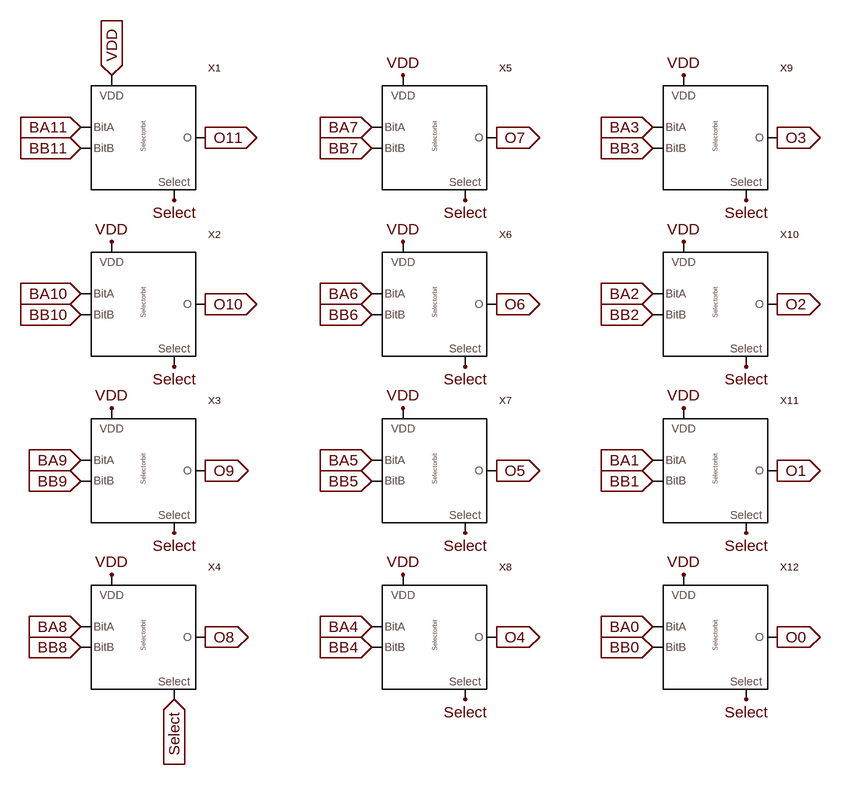
[diagram p0: schematic 12_bit_selector.asc]
12_bit_selector.asc, the LTspice schematic file:
Version 4
SHEET 1 892 944
FLAG 176 80 VDD
FLAG 128 -96 BA7
IOPIN 128 -96 In
FLAG 128 -64 BB7
IOPIN 128 -64 In
FLAG 128 160 BA6
IOPIN 128 160 In
FLAG 128 192 BB6
IOPIN 128 192 In
FLAG 320 -80 O7
IOPIN 320 -80 Out
FLAG 320 176 O6
IOPIN 320 176 Out
FLAG 176 592 VDD
FLAG 128 416 BA5
IOPIN 128 416 In
FLAG 128 448 BB5
IOPIN 128 448 In
FLAG 128 672 BA4
IOPIN 128 672 In
FLAG 128 704 BB4
IOPIN 128 704 In
FLAG 320 432 O5
IOPIN 320 432 Out
FLAG 320 688 O4
IOPIN 320 688 Out
FLAG 176 336 VDD
FLAG 608 80 VDD
FLAG 560 -96 BA3
IOPIN 560 -96 In
FLAG 560 -64 BB3
IOPIN 560 -64 In
FLAG 560 160 BA2
IOPIN 560 160 In
FLAG 560 192 BB2
IOPIN 560 192 In
FLAG 752 -80 O3
IOPIN 752 -80 Out
FLAG 752 176 O2
IOPIN 752 176 Out
FLAG 608 592 VDD
FLAG 560 416 BA1
IOPIN 560 416 In
FLAG 560 448 BB1
IOPIN 560 448 In
FLAG 560 672 BA0
IOPIN 560 672 In
FLAG 560 704 BB0
IOPIN 560 704 In
FLAG 752 432 O1
IOPIN 752 432 Out
FLAG 752 688 O0
IOPIN 752 688 Out
FLAG 608 336 VDD
FLAG 608 -176 VDD
FLAG -272 -176 VDD
IOPIN -272 -176 In
FLAG -272 80 VDD
FLAG -320 -96 BA11
IOPIN -320 -96 In
FLAG -320 -64 BB11
IOPIN -320 -64 In
FLAG -320 160 BA10
IOPIN -320 160 In
FLAG -320 192 BB10
IOPIN -320 192 In
FLAG -128 -80 O11
IOPIN -128 -80 Out
FLAG -128 176 O10
IOPIN -128 176 Out
FLAG -272 592 VDD
FLAG -320 416 BA9
IOPIN -320 416 In
FLAG -320 448 BB9
IOPIN -320 448 In
FLAG -320 672 BA8
IOPIN -320 672 In
FLAG -320 704 BB8
IOPIN -320 704 In
FLAG -128 432 O9
IOPIN -128 432 Out
FLAG -128 688 O8
IOPIN -128 688 Out
FLAG -272 336 VDD
FLAG 176 -176 VDD
FLAG -176 16 Select
FLAG 272 16 Select
FLAG 704 16 Select
FLAG 704 272 Select
FLAG 272 272 Select
FLAG -176 272 Select
FLAG -176 528 Select
FLAG 272 528 Select
FLAG 704 528 Select
FLAG 704 784 Select
FLAG 272 784 Select
FLAG -176 784 Select
IOPIN -176 784 In
SYMBOL Selectorbit -304 0 R0
SYMATTR InstName X1
SYMBOL Selectorbit -304 256 R0
SYMATTR InstName X2
SYMBOL Selectorbit -304 512 R0
SYMATTR InstName X3
SYMBOL Selectorbit -304 768 R0
SYMATTR InstName X4
SYMBOL Selectorbit 144 0 R0
SYMATTR InstName X5
SYMBOL Selectorbit 144 256 R0
SYMATTR InstName X6
SYMBOL Selectorbit 144 512 R0
SYMATTR InstName X7
SYMBOL Selectorbit 144 768 R0
SYMATTR InstName X8
SYMBOL Selectorbit 576 0 R0
SYMATTR InstName X9
SYMBOL Selectorbit 576 256 R0
SYMATTR InstName X10
SYMBOL Selectorbit 576 512 R0
SYMATTR InstName X11
SYMBOL Selectorbit 576 768 R0
SYMATTR InstName X12

The netlist it stands for:
* 12_bit_selector.asc
XX1 BA11 BB11 O11 Select VDD Selectorbit  ; pins BitA BitB O Select VDD
XX2 BA10 BB10 O10 Select VDD Selectorbit  ; pins BitA BitB O Select VDD
XX3 BA9 BB9 O9 Select VDD Selectorbit  ; pins BitA BitB O Select VDD
XX4 BA8 BB8 O8 Select VDD Selectorbit  ; pins BitA BitB O Select VDD
XX5 BA7 BB7 O7 Select VDD Selectorbit  ; pins BitA BitB O Select VDD
XX6 BA6 BB6 O6 Select VDD Selectorbit  ; pins BitA BitB O Select VDD
XX7 BA5 BB5 O5 Select VDD Selectorbit  ; pins BitA BitB O Select VDD
XX8 BA4 BB4 O4 Select VDD Selectorbit  ; pins BitA BitB O Select VDD
XX9 BA3 BB3 O3 Select VDD Selectorbit  ; pins BitA BitB O Select VDD
XX10 BA2 BB2 O2 Select VDD Selectorbit  ; pins BitA BitB O Select VDD
XX11 BA1 BB1 O1 Select VDD Selectorbit  ; pins BitA BitB O Select VDD
XX12 BA0 BB0 O0 Select VDD Selectorbit  ; pins BitA BitB O Select VDD
.backanno
.end